# Altium schematic sheet Thermocouple.SchDoc
size A
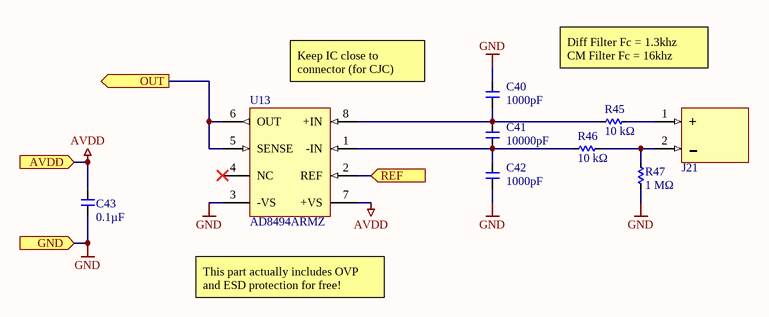
[diagram p0: Thermocouple.SchDoc]

## Parts
C40  Capacitance (shorthand): 1000pF  [C0603]  (hidden comment: 490-1494-1-ND)
C41  Capacitance (shorthand): 10000pF  [C0603]  (hidden comment: 490-1512-1-ND)
C42  Capacitance (shorthand): 1000pF  [C0603]  (hidden comment: 490-1494-1-ND)
C43  Capacitance (shorthand): 0.1µF  [C0603]  (hidden comment: 490-1519-1-ND)
J21  PCC-SMP-V-K  [PCC-SMP-V-K-Footprint-1]  (value not drawn)
R45  Resistance: 10 kΩ  [R0603]  (hidden comment: 311-10.0KHRCT-ND)
R46  Resistance: 10 kΩ  [R0603]  (hidden comment: 311-10.0KHRCT-ND)
R47  Resistance: 1 MΩ  [R0603]  (hidden comment: 311-1.00MHRCT-ND)
U13  AD8494ARMZ  [ADI-RM-8_N]

## Ports
AVDD (in), GND (in), OUT (out), REF (in)

## Nets
AVDD: C43.1 U13.7(+VS) ; port AVDD
GND: C40.1 C42.2 C43.2 R47.1 U13.3(-VS) ; port GND
OUT: U13.5(SENSE) U13.6(OUT) ; port OUT
REF: U13.2(REF) ; port REF
NetC40_2: C40.2 C41.1 R45.1 U13.8(+IN)
NetC41_2: C41.2 C42.1 R46.1 U13.1(-IN)
NetJ21_1: J21.1(+) R45.2
NetJ21_2: J21.2(-) R46.2 R47.2

Not connected (* = marked no-connect by the designer): U13 4(NC)*

## Notes on the sheet
- (near U13) Keep IC close to connector (for CJC)
- Diff Filter Fc = 1.3khz
  CM Filter Fc = 16khz
- This part actually includes OVP and ESD protection for free!

## Library data of the parts
C40 C42 = CMP-119-0040-1: CAP CER 0603 1000pF X7R 50V 10%; Manufacturer: Murata Electronics North America; Capacitance - pF (Machine readable): #NAME?; Dielectric: X7R; Rated Voltage: 50V
C41 = CMP-119-0053-1: CAP CER 0603 10000pF X7R 50V 10%; Manufacturer: Murata Electronics North America; Capacitance - pF (Machine readable): #NAME?; Rated Voltage: 50V; Dielectric: X7R
C43 = CMP-119-0065-1: CAP CER 0603 0.1µF X7R 50V 10%; Manufacturer: Murata Electronics North America; Capacitance - pF (Machine readable): #NAME?; Dielectric: X7R; Rated Voltage: 50V
J21 = CMP-00005-1: THERMOCOUPLE CONN, K TYPE, RCPT; Gender: Receptacle; Thermocouple Type: K; Product Range: PCC SMP Series; Junction Type: K
R45 R46 = CMP-126-0273-2: RES SMD 10K OHM 1% 1/10W 0603; Manufacturer Part Number: RC0603FR-0710KL; Manufacturer: Yageo; Power (Watts): 0.1W, 1/10W; Temperature Coefficient: ±100ppm/°C; Resistance (Sortable): 10000; Tolerance: ±1%; Operating Temperature: -55°C ~ 155°C; Datasheets: http://www.yageo.com/documents/recent/PYu-RC_Group_51_RoHS_L_9.pdf; Image: //media.digikey.com/Renders/Yageo%20Renders/0603-(1608-Metric).jpg
R47 = CMP-126-0484-2: RES SMD 1M OHM 1% 1/10W 0603; Manufacturer Part Number: RC0603FR-071ML; Manufacturer: Yageo; Power (Watts): 0.1W, 1/10W; Resistance (Sortable): 1000000; Temperature Coefficient: ±100ppm/°C; Operating Temperature: -55°C ~ 155°C; Image: //media.digikey.com/Renders/Yageo%20Renders/0603-(1608-Metric).jpg; Datasheets: http://www.yageo.com/documents/recent/PYu-RC_Group_51_RoHS_L_9.pdf; Tolerance: ±1%
U13 = CMP-00003-2: IC THRMOCPLE COLD JNC COMP 8MSOP; Nominal Supply Current: 180uA; Max Supply Current: 250uA; Output Type: Analog; Gain Bandwidth Product: 30kHz; Max Supply Voltage: 18V; Min Supply Voltage: 2.7V; Length: 3.2mm; Height: 0.95mm; Contact Plating: Tin,Matte; Package Quantity: 50; REACH SVHC: No SVHC; Operating Supply Current: 180uA; Max Operating Temperature: 125°C; Case/Package: MSOP; Min Operating Temperature: -40°C; Packaging: Rail/Tube; Number of Pins: 8; Lead Free: Contains Lead; Dual Supply Voltage: 18V; Width: 3.2mm